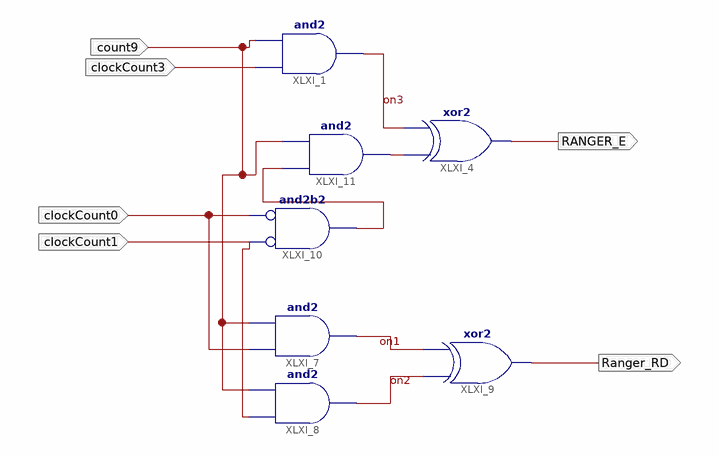
[diagram p0: schematic sheet 1]
// Xilinx ISE schematic RANGER_EN.sch (spartan3e) as structural Verilog: 7 symbols, 6 ports
module RANGER_EN (
  input  count9,
  input  clockCount3,
  input  clockCount0,
  input  clockCount1,
  output RANGER_E,
  output Ranger_RD
);

  wire on1, on2, on3, XLXN_19, XLXN_20;

  and XLXI_1 (on3, clockCount3, count9);
  xor XLXI_4 (RANGER_E, XLXN_19, on3);
  and XLXI_7 (on1, clockCount0, count9);
  and XLXI_8 (on2, clockCount1, count9);
  xor XLXI_9 (Ranger_RD, on2, on1);
  and XLXI_10 (XLXN_20, ~clockCount1, ~clockCount0);  // and2b2
  and XLXI_11 (XLXN_19, XLXN_20, count9);
endmodule
